# Altium project PCB Project1.PrjPCB
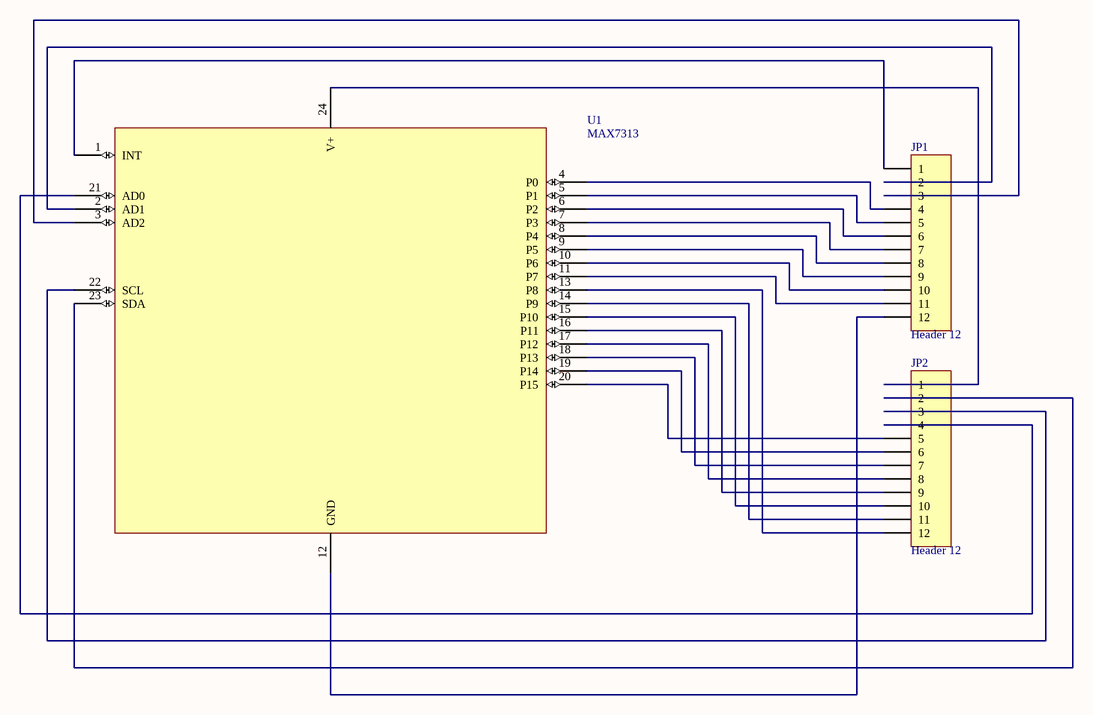
[diagram p0: Sheet1.SchDoc]
3 sheets, 5 parts. Net scope: global (net labels, ports and power ports of the same name join across sheets).
Board files: PCB5.PcbDoc, PCB1.PcbDoc, PCB2.PcbDoc, PCB3.PcbDoc, PCB4.PcbDoc
Sheets:
  Sheet1.SchDoc
  Sheet2.SchDoc
  Sheet3.SchDoc

## Sheet Sheet1.SchDoc
size B

### Parts
(Parts that share a designator on the sheet are numbered #1, #2 ... from top to bottom, then left to right.)
JP1  Header 12  [HDR1X12]
JP2  Header 12  [HDR1X12]
U1#1  MAX7313  [QSOP24]

### Nets
NetJP1_1: JP1.1 U1#1.1(INT)
NetJP1_2: JP1.2 U1#1.2(AD1)
NetJP1_3: JP1.3 U1#1.3(AD2)
NetJP1_4: JP1.4 U1#1.4(P0)
NetJP1_5: JP1.5 U1#1.5(P1)
NetJP1_6: JP1.6 U1#1.6(P2)
NetJP1_7: JP1.7 U1#1.7(P3)
NetJP1_8: JP1.8 U1#1.8(P4)
NetJP1_9: JP1.9 U1#1.9(P5)
NetJP1_10: JP1.10 U1#1.10(P6)
NetJP1_11: JP1.11 U1#1.11(P7)
NetJP1_12: JP1.12 U1#1.12(GND)
NetJP2_1: JP2.1 U1#1.24(V+)
NetJP2_2: JP2.2 U1#1.23(SDA)
NetJP2_3: JP2.3 U1#1.22(SCL)
NetJP2_4: JP2.4 U1#1.21(AD0)
NetJP2_5: JP2.5 U1#1.20(P15)
NetJP2_6: JP2.6 U1#1.19(P14)
NetJP2_7: JP2.7 U1#1.18(P13)
NetJP2_8: JP2.8 U1#1.17(P12)
NetJP2_9: JP2.9 U1#1.16(P11)
NetJP2_10: JP2.10 U1#1.15(P10)
NetJP2_11: JP2.11 U1#1.14(P9)
NetJP2_12: JP2.12 U1#1.13(P8)

### Library data of the parts
JP1 JP2 = Header 12: Header, 12-Pin; Manufacturer: Generic Components; Class: Connector

## Sheet Sheet2.SchDoc
size B

## Sheet Sheet3.SchDoc
size A
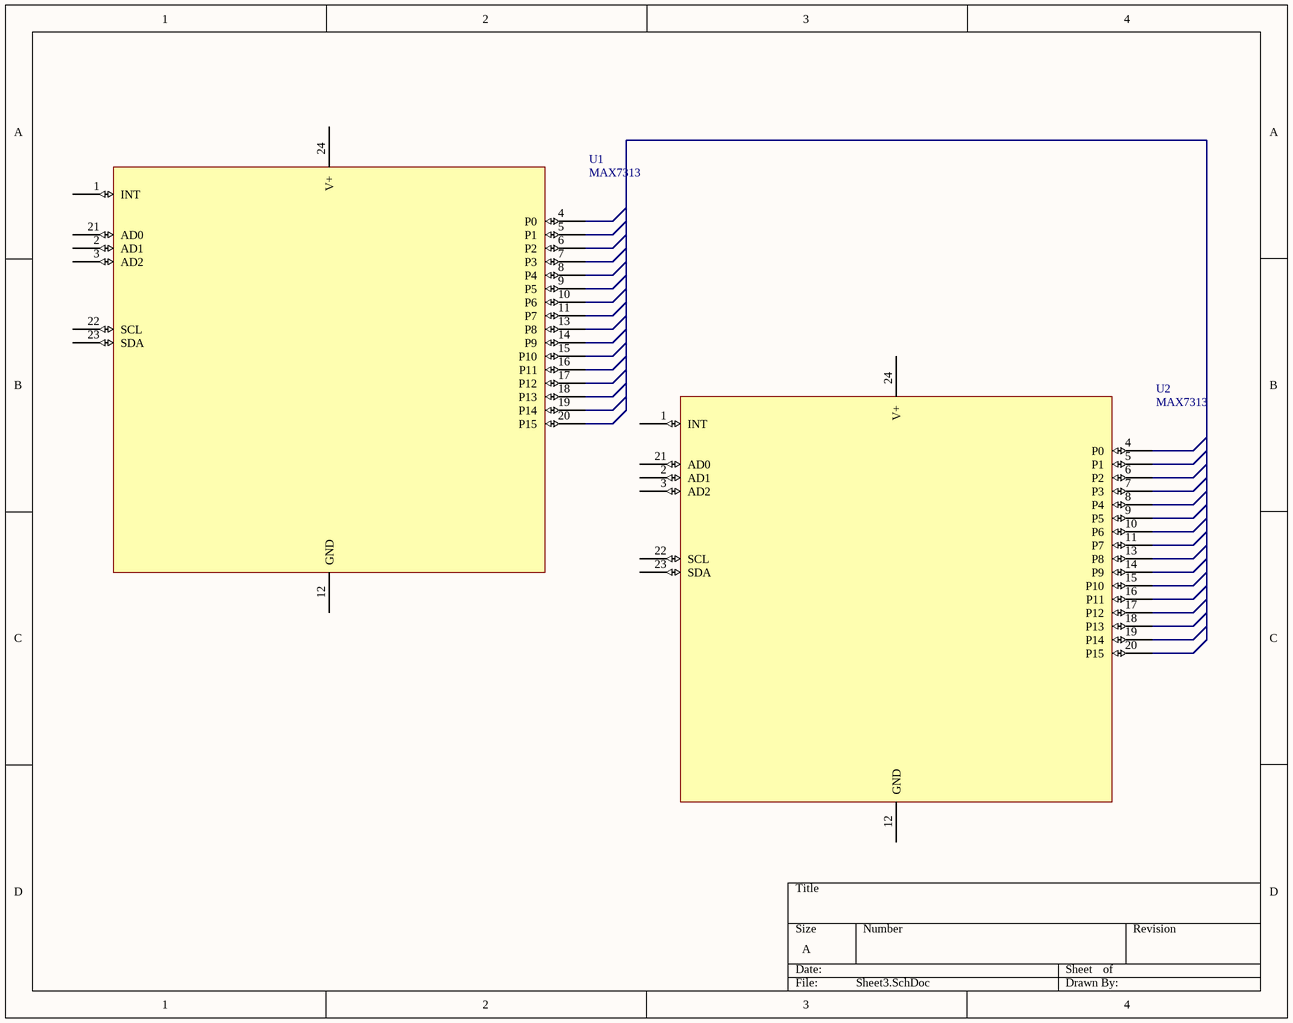
[diagram p1: Sheet3.SchDoc]

### Parts
(Parts that share a designator on the sheet are numbered #1, #2 ... from top to bottom, then left to right.)
U1#2  MAX7313  [QSOP24]
U2  MAX7313  [QSOP24]

### Nets

Not connected (* = marked no-connect by the designer): U1#2 1(INT) 2(AD1) 3(AD2) 4(P0) 5(P1) 6(P2) 7(P3) 8(P4) 9(P5) 10(P6) 11(P7) 12(GND) 13(P8) 14(P9) 15(P10) 16(P11) 17(P12) 18(P13) 19(P14) 20(P15) 21(AD0) 22(SCL) 23(SDA) 24(V+); U2 1(INT) 2(AD1) 3(AD2) 4(P0) 5(P1) 6(P2) 7(P3) 8(P4) 9(P5) 10(P6) 11(P7) 12(GND) 13(P8) 14(P9) 15(P10) 16(P11) 17(P12) 18(P13) 19(P14) 20(P15) 21(AD0) 22(SCL) 23(SDA) 24(V+)